# EAGLE design SomUSB2 (EAGLE 9.6.2)
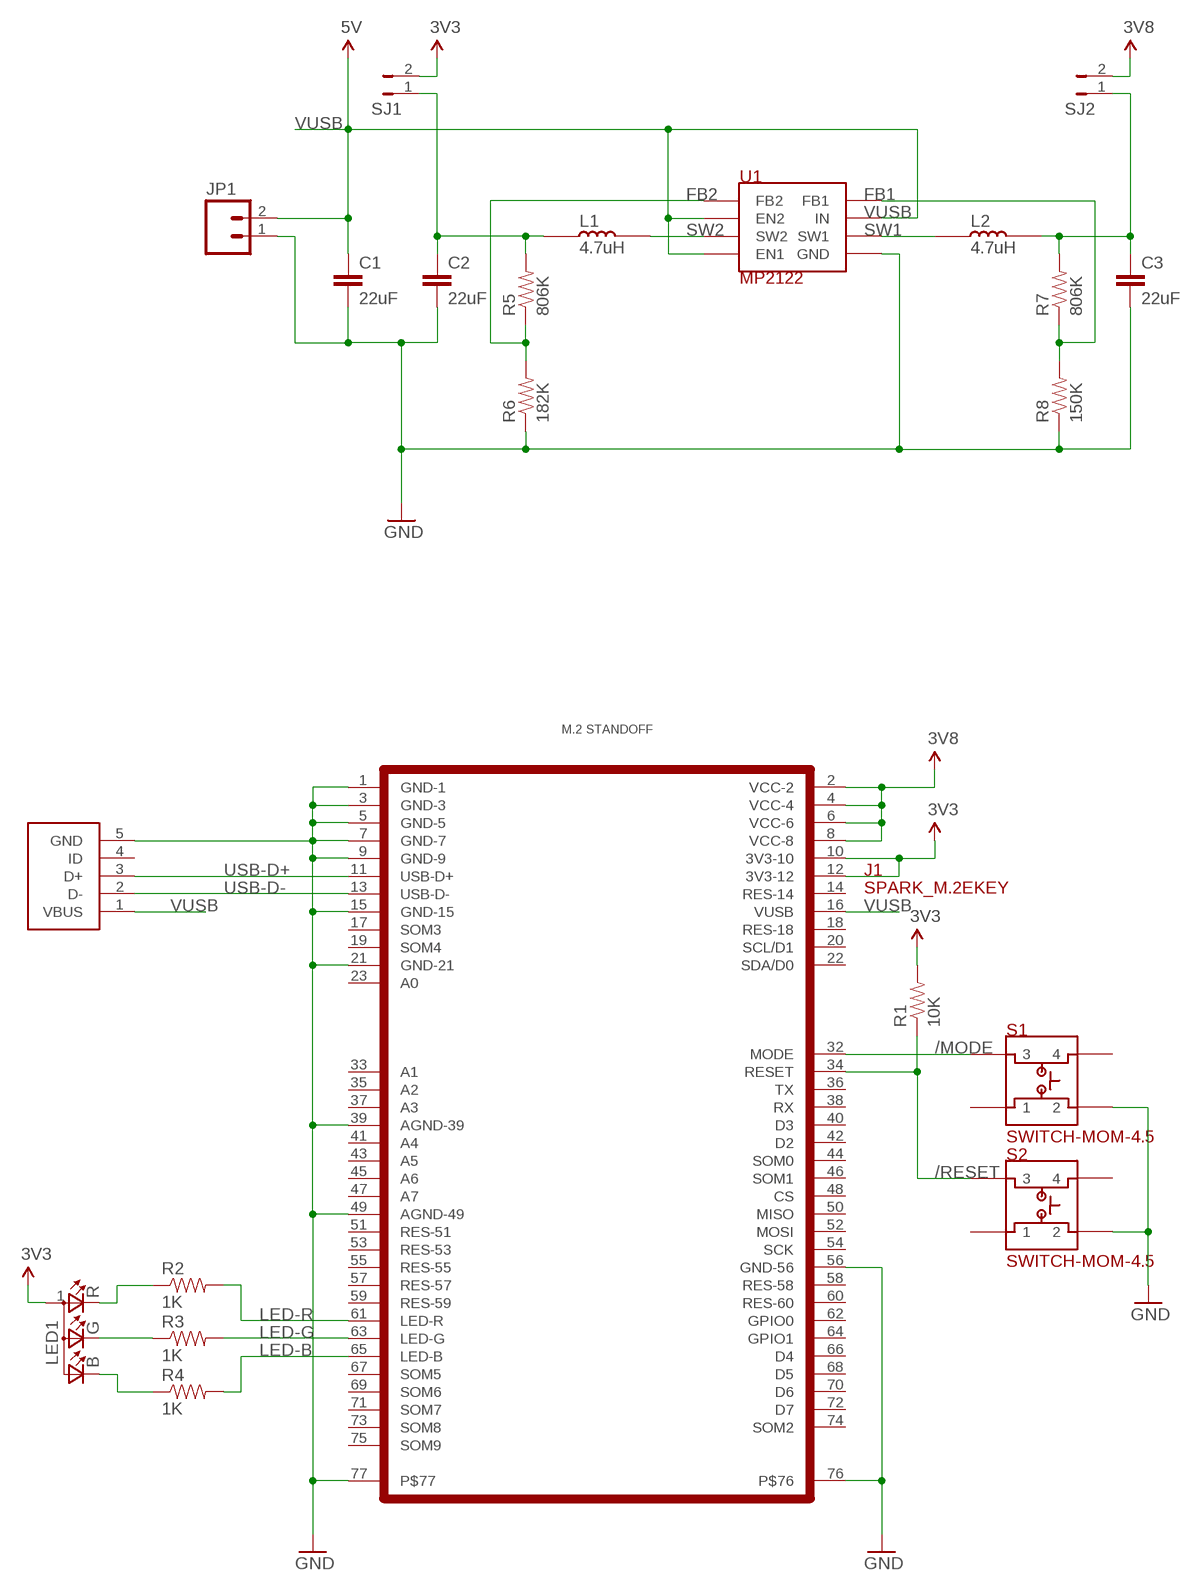
[diagram p0: schematic, sheet 1]

## Parts
C1  22uF  CAP-22UF-0805  [0805]
C2  22uF  CAP-22UF-0805  [0805]
C3  22uF  CAP-22UF-0805  [0805]
J1  SPARK_M.2EKEY  [SPARK_M.2EKEY-LESS-CREAM]
JP1  M02PTH  [1X02]
L1  4.7uH  INDUCTOR-4.7UH  [1008-BOURNS]
L2  4.7uH  INDUCTOR-4.7UH  [1008-BOURNS]
LED1  LED-RGB-CREE-SMD  [LED-RGB-CREE-SMD]
R1  10K  RES-10K-06030603  [0603-RES]
R2  1K  RES-1K-0603  [0603-RES]
R3  1K  RES-1K-0603  [0603-RES]
R4  1K  RES-1K-0603  [0603-RES]
R5  806K  RES-806K-0603  [0603-RES]
R6  182K  RES-182K-0603  [0603-RES]
R7  806K  RES-806K-0603  [0603-RES]
R8  150K  RES-150K-0603  [0603-RES]
S1  SWITCH-MOM-4.5  [SWITCH-MOM-4.5]
S2  SWITCH-MOM-4.5  [SWITCH-MOM-4.5]
SJ1  JUMPER-PTH-2-NO  [PTH-JUMPER-2-NO_NO_SILK]
SJ2  JUMPER-PTH-2-NO  [PTH-JUMPER-2-NO_NO_SILK]
U1  MP2122  MPS2112  [TSOT23-8-MPS]
U$1  M2-STANDOFF  [M2-STANDOFF]
U$3  USB-MICRO-B-SOCKET-AMPHENOL  [USB-B-SMT-AMPHENOL]

## Nets
3V3: J1.10(3V3-10) J1.12(3V3-12) LED1.1(A) R1.2 SJ1.2
3V3-REG: C2.1 L1.1 R5.2 SJ1.1
3V8: J1.2(VCC-2) J1.4(VCC-4) J1.6(VCC-6) J1.8(VCC-8) SJ2.2
3V8-REG: C3.1 L2.2 R7.2 SJ2.1
/MODE: J1.32(MODE) S1.3
/RESET: J1.34(RESET) R1.1 S2.3
FB1: R7.1 R8.2 U1.8(FB1)
FB2: R5.1 R6.2 U1.1(FB2)
GND: C1.2 C2.2 C3.2 J1.1(GND-1) J1.3(GND-3) J1.5(GND-5) J1.7(GND-7) J1.9(GND-9) J1.15(GND-15) J1.21(GND-21) J1.39(AGND-39) J1.49(AGND-49) J1.56(GND-56) J1.76 J1.77 JP1.1 R6.1 R8.1 S1.2 S2.2 U1.5(GND) U$3.5(GND)
LED-B: J1.65(LED-B) R4.2
LED-G: J1.63(LED-G) R3.2
LED-R: J1.61(LED-R) R2.2
N$2: LED1.3(G) R3.1
N$6: LED1.4(R) R2.1
N$10: LED1.2(B) R4.1
SW1: L2.1 U1.6(SW1)
SW2: L1.2 U1.3(SW2)
USB-D+: J1.11(USB-D+) U$3.3(D+)
USB-D-: J1.13(USB-D-) U$3.2(D-)
VUSB: C1.1 J1.16(VUSB) JP1.2 U1.2(EN2) U1.4(EN1) U1.7(IN) U$3.1(VBUS) ; supply symbol labelled 5V
Unconnected: J1.14(RES-14) J1.17(SOM3) J1.18(RES-18) J1.19(SOM4) J1.20(SCL/D1) J1.22(SDA/D0) J1.23(A0) J1.33(A1) J1.35(A2) J1.36(TX) J1.37(A3) J1.38(RX) J1.40(D3) J1.41(A4) J1.42(D2) J1.43(A5) J1.44(SOM0) J1.45(A6) J1.46(SOM1) J1.47(A7) J1.48(CS) J1.50(MISO) J1.51(RES-51) J1.52(MOSI) J1.53(RES-53) J1.54(SCK) J1.55(RES-55) J1.57(RES-57) J1.58(RES-58) J1.59(RES-59) J1.60(RES-60) J1.62(GPIO0) J1.64(GPIO1) J1.66(D4) J1.67(SOM5) J1.68(D5) J1.69(SOM6) J1.70(D6) J1.71(SOM7) J1.72(D7) J1.73(SOM8) J1.74(SOM2) J1.75(SOM9) S1.1 S1.4 S2.1 S2.4 U$3.4(ID)

## Library data of the parts
C1-C3 = rickk2:CAP-22UF-0805: 22 uF capacitor 6.3V 0805 $ .314 https://www.digikey.com/product-detail/en/murata-electronics-north-america/GRM219R61A226MEA0D/490-9951-1-ND/5026414
J1 = rickk2:SPARK_M.2EKEY: $1.42 CONN FEMALE 67POS 0.020 GOLD TE Connectivity AMP Connectors 2199230-4 https://www.digikey.com/product-detail/en/te-connectivity-amp-connectors/2199230-4/A115904CT-ND/4208916
JP1 = rickk2:M02: Standard 2-pin 0.1" header. Use with - straight break away headers ( PRT-00116) - right angle break away headers (PRT-00553) - swiss pins (PRT-00743) - machine pins (PRT-00117) - female headers (PRT-00115) Molex polarized connector foot print use with: PRT-08233 with associated crimp pins and housings. 2.54_SCREWTERM for use with PRT-10571. 3.5mm Screw Terminal footprints for PRT-08084 5mm Screw Terminal footprints for use with PRT-08432
L1 L2 = rickk2:INDUCTOR-4.7UH: FIXED IND 4.7UH 1.1A 110 MOHM $0.26 Bourns CVH252009-4R7M 4.7µH Shielded Multilayer Inductor 1.1A 110 mOhm Max 1008 (2520 Metric) https://www.digikey.com/product-detail/en/bourns-inc/CVH252009-4R7M/CVH252009-4R7MCT-ND/3440080
LED1 = rickk2:LED-RGB-CREE-SMD: LED RGB DIFFUSED 4SMD $ 0.35 Cree CLMVB-FKA-CFHEHLCBB7A363 2mm 4-PLCC common anode RGB LED https://www.digikey.com/product-detail/en/cree-inc/CLMVB-FKA-CFHEHLCBB7A363/CLMVB-FKA-CFHEHLCBB7A363CT-ND/6138627 Red=68 ohm, Green/Blue=33 ohm @ 3.3V
R1 = rickk2:RES-10K-0603: RES SMD 10K OHM 5% 1/4W 0603 $ 0.10 https://www.digikey.com/product-detail/en/panasonic-electronic-components/ERJ-PA3J103V/P10KBZCT-ND/5036237
R2-R4 = rickk2:RES-1K-0603: RES SMD 1K OHM 0.5% 1/5W 0603 $ 0.17 https://www.digikey.com/product-detail/en/panasonic-electronic-components/ERJ-PB3D1001V/P20283CT-ND/6214538 Panasonic
R5 R7 = rickk2:RES-806K-0603: Panasonic Electronic Components ERJ-3EKF8063V 806 kOhms ±1% 0.1W, 1/10W Chip Resistor 0603 (1608 Metric) Automotive AEC-Q200 Thick Film https://www.digikey.com/products/en/resistors/chip-resistor-surface-mount/52?k=&pkeyword=&sv=0&v=10&pv7=2&pv1989=0&pv2085=u806+kOhms&pv16=5&sf=1&FV=ffe00034&quantity=&ColumnSort=0&page=1&stock=1&pageSize=25
R6 = rickk2:RES-182K-0603: Panasonic Electronic Components ERJ-3EKF1823V 182 kOhms ±1% 0.1W, 1/10W Chip Resistor 0603 (1608 Metric) Automotive AEC-Q200 Thick Film https://www.digikey.com/product-detail/en/panasonic-electronic-components/ERJ-3EKF1823V/P182KHCT-ND/198208
R8 = rickk2:RES-150K-0603: RES SMD 150K OHM 1% 1/10W 0603 Panasonic Electronic Components ERJ-3EKF1503V 150 kOhms ±1% 0.1W, 1/10W Chip Resistor 0603 (1608 Metric) Automotive AEC-Q200 Thick Film https://www.digikey.com/product-detail/en/panasonic-electronic-components/ERJ-3EKF1503V/P150KHCT-ND/198178
S1 S2 = rickk2:SWITCH-MOM-4.5: Manufacturer: E-Switch Manufacturer Part Number: TL3305AF160QG Description: SWITCH TACTILE SPST-NO 50MA 12V Detailed Description: Tactile Switch SPST-NO Top Actuated Surface Mount $0.20 https://www.digikey.com/product-detail/en/e-switch/TL3305AF160QG/EG5350CT-ND/5816195
SJ1 SJ2 = rickk2:JUMPER-PTH-2-NO
U1 = rickk2:MPS2112: Monolithic Power Systems Inc. MP2122GJ-Z $2.51 IC REG BUCK ADJ 2A DL SYNC Buck Switching Regulator IC Positive Adjustable 0.608V 2 Output 2A SOT-23-8 Thin, TSOT-23-8 https://www.digikey.com/product-detail/en/monolithic-power-systems-inc/MP2122GJ-Z/1589-1872-1-ND/5291939
U$1 = rickk2:M2-STANDOFF: https://www.digikey.com/product-detail/en/jae-electronics/SM3ZS067U310-NUT1-R1800/670-2864-1-ND/5955848
U$3 = rickk2:USB-MICRO-B-SOCKET-AMPHENOL: CONN USB MICRO B RECPT SMT R/A $0.42 Amphenol FCI 10118194-0001LF https://www.digikey.com/products/en?keywords=609-4618-1-nd

## Board
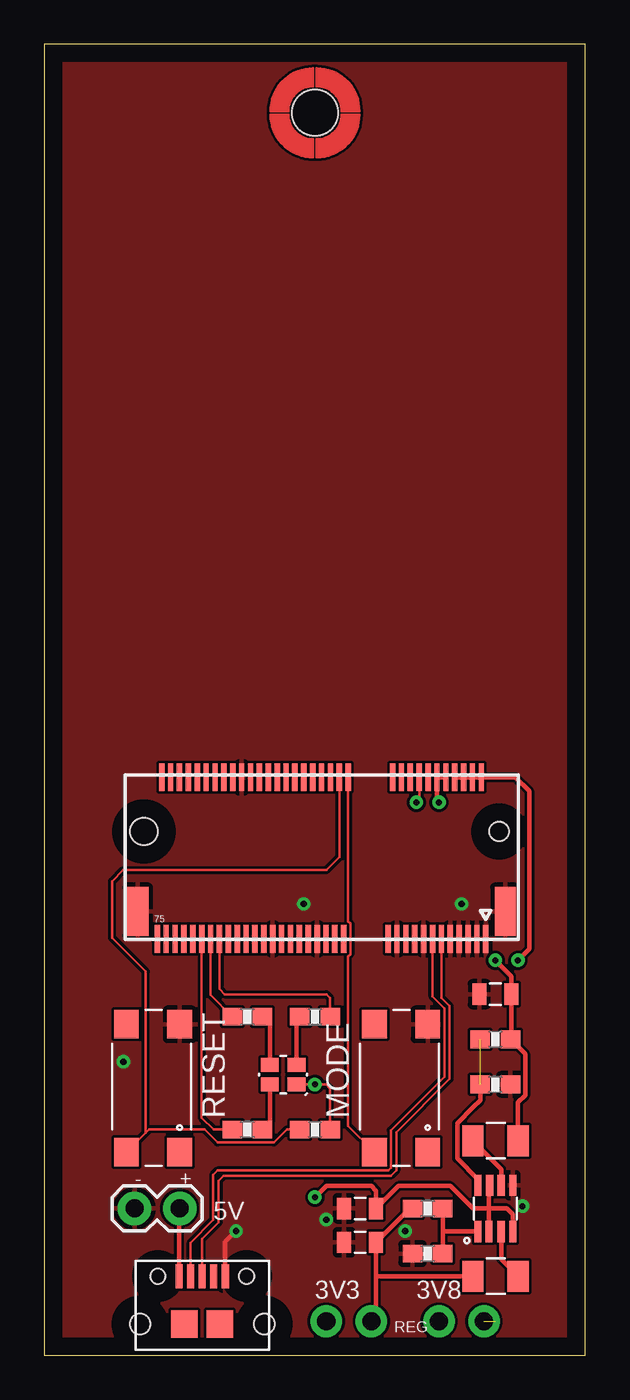
[diagram p1: board, top side]
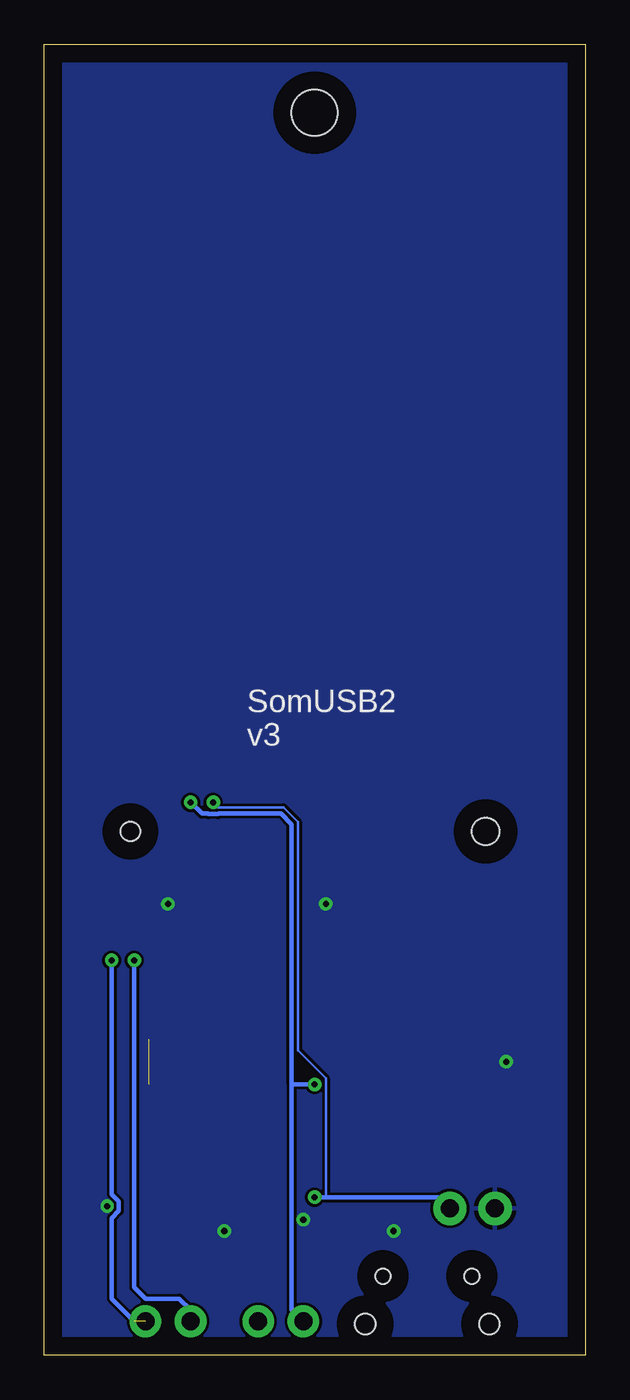
[diagram p2: board, bottom side, seen from below]

Size 30.46 x 73.79 mm. Coordinates in mm from the lower left corner, seen from the top.
Outline: 0,0 30.46,0 30.46,73.79 0,73.79 0,0
Copper layers (1*16): Top 0.035mm / dielectric 1.5mm / Bottom 0.035mm
Design rules "default": minimum track width 6mil, minimum drill 0.35mm, track to track 6mil, track to pad 6mil, pad to pad 6mil, via to via 6mil, smd to smd 6mil, copper to edge 40mil, drill to drill 6mil, minimum pad ring 10mil, minimum via ring 8mil, stop-mask expansion 4mil, vias tented up to drill 0mil, thermal gap 10mil

### Footprints (pad centres in the part's own frame; a part is rotated, then mirrored left to right if it is on the bottom)
0805 = smd 0.8 x 1.2: 1 -0.9,0; 2 0.9,0
SPARK_M.2EKEY-LESS-CREAM = smd 0.3 x 1.55: 1 -9.62,4.51; 2 -9.37,-4.59; 3 -9.12,4.51; 4 -8.87,-4.59; 5 -8.62,4.51; 6 -8.37,-4.59; 7 -8.12,4.51; 8 -7.87,-4.59; 9 -7.62,4.51; 10 -7.37,-4.59; 11 -7.12,4.51; 12 -6.87,-4.59; 13 -6.62,4.51; 14 -6.37,-4.59; 15 -6.12,4.51; 16 -5.87,-4.59; 17 -5.62,4.51; 18 -5.37,-4.59; 19 -5.12,4.51; 20 -4.87,-4.59; 21 -4.62,4.51; 22 -4.37,-4.59; 23 -4.12,4.51; 32 -1.87,-4.59; 33 -1.62,4.51; 34 -1.37,-4.59; 35 -1.12,4.51; 36 -0.87,-4.59; 37 -0.62,4.51; 38 -0.37,-4.59; 39 -0.12,4.51; 40 0.13,-4.59; 41 0.38,4.51; 42 0.63,-4.59; 43 0.88,4.51; 44 1.13,-4.59; 45 1.38,4.51; 46 1.63,-4.59; 47 1.88,4.51; 48 2.13,-4.59; 49 2.38,4.51; 50 2.63,-4.59; 51 2.88,4.51; 52 3.13,-4.59; 53 3.38,4.51; 54 3.63,-4.59; 55 3.88,4.51; 56 4.13,-4.59; 57 4.38,4.51; 58 4.63,-4.59; 59 4.88,4.51; 60 5.13,-4.59; 61 5.38,4.51; 62 5.63,-4.59; 63 5.88,4.51; 64 6.13,-4.59; 65 6.38,4.51; 66 6.63,-4.59; 67 6.88,4.51; 68 7.13,-4.59; 69 7.38,4.51; 70 7.63,-4.59; 71 7.88,4.51; 72 8.13,-4.59; 73 8.38,4.51; 74 8.63,-4.59; 75 8.88,4.51 | smd 1.2 x 2.75: 76 9.98,2.96; 77 -10.72,2.96 | hole 1.1: -10.37,-1.54 | hole 1.55: 9.63,-1.54
1X02 = drill 1.016 pad 1.88: 1 0,0; 2 2.54,0
1008-BOURNS = smd 1.2 x 1.75: 1 0,0; 2 2.55,0
LED-RGB-CREE-SMD = smd 1 x 0.8: 1 1.5,0; 2 0,0; 3 0,1.1; 4 1.5,1.1
0603-RES = smd 1.1 x 1: 1 -0.85,0; 2 0.85,0
SWITCH-MOM-4.5 = smd 1.6 x 1.4: 1 0,0; 2 7.2,0; 3 0,3; 4 7.2,3
PTH-JUMPER-2-NO_NO_SILK = drill 1.016 pad 1.778: 1 -1.27,0; 2 1.27,0
TSOT23-8-MPS = smd 0.4 x 1.2: 1 -0.975,-1.3; 2 -0.375,-1.3; 3 0.325,-1.3; 4 0.975,-1.3; 5 0.975,1.3; 6 0.325,1.3; 7 -0.325,1.3; 8 -0.975,1.3
M2-STANDOFF = hole 2.6: 0,0
USB-B-SMT-AMPHENOL = smd 0.4 x 1.35: 1 -1.3,0; 2 -0.65,0; 3 0,0; 4 0.65,0; 5 1.3,0 | smd 1.5 x 1.55: P$6 -1,-2.7; P$7 1,-2.7 | hole 0.85: -2.5,0; 2.5,0 | hole 1.15: -3.5,-2.7; 3.5,-2.7

### Placement (x,y rotation side)
C1  17.78,8.26 180 top
C2  17.78,6.35 180 top
C3  25.4,20.32 180 top
J1  15.24,27.94 180 top
JP1  5.08,8.26 0 top
L1  24.13,4.45 0 top
L2  24.13,12.06 0 top
LED1  12.7,15.24 0 top
R1  15.24,12.7 0 top
R2  15.24,19.05 0 top
R3  11.43,19.05 180 top
R4  11.43,12.7 180 top
R5  21.59,8.26 180 top
R6  21.59,5.71 0 top
R7  25.4,17.78 0 top
R8  25.4,15.24 180 top
S1  21.59,11.43 90 top
S2  7.62,11.43 90 top
SJ1  17.14,1.91 180 top
SJ2  23.5,1.91 0 top
U1  25.4,8.26 0 top
U$1  15.24,69.94 0 top
U$3  8.89,4.45 0 top

### Tracks (layer width: path | path; a pad name or v marks a point on that pad's centre or on a via)
3V3  (via drill 0.35)
  Top 0.152: LED1.1 v15.24,15.24 15.88,15.24 16.09,15.03 R1.2
  Top 0.254: v22.23,31.11 22.11,31.23 J1.12 J1.10
  Bottom 0.254: 16.53,15.24 16.53,2.56 SJ1.2 | v15.24,15.24 16.53,15.24 | 16.53,15.24 16.53,29.87 17.14,30.48 20.66,30.48 20.68,30.46 21.23,30.46 21.25,30.48 21.59,30.48 v22.23,31.11
3V3-REG
  Top 0.254: R5.2 20.59,8.26 C2.1 18.68,4.45 | SJ1.1 18.68,2.17 18.68,4.45 | L1.1 18.68,4.45
3V8  (via drill 0.35)  (1 unrouted)
  Top 0.254: J1.8 J1.6 J1.4 J1.2 26.52,32.53 27.3,31.75 27.3,22.86 v26.67,22.23
  Bottom 0.254: v26.67,22.23 26.67,9.06 26.27,8.65 26.27,8.11 26.67,7.71 26.67,3.17 25.4,1.91
3V8-REG  (via drill 0.35)
  Top 0.254: L2.2 26.68,14.22 27.08,14.62 27.08,16.95 R7.2 26.3,17.83 C3.1 26.3,21.32 v25.4,22.23
  Bottom 0.254: SJ2.1 22.23,2.54 22.86,3.17 24.77,3.17 25.4,3.81 v25.4,22.23
/MODE
  Top 0.152: S1.3 17.11,12.91 17.11,22.43 17.24,22.56 17.24,24.3 17.11,24.43 J1.32
/RESET
  Top 0.152: 5.71,12.53 5.71,21.59 3.81,23.5 3.81,26.67 4.45,27.3 15.88,27.3 16.61,28.04 J1.34 | 5.71,12.53 5.89,12.7 9.02,12.7 9.75,11.97 12.93,11.97 13.65,12.7 R1.1 | S2.3 5.71,12.53
FB1  (1 unrouted)
  Top 0.254: U1.8 24.43,9.9 23.25,11.07 23.25,13.06 24.15,13.95 24.55,14.36 R8.2
FB2
  Top 0.254: R5.1 22.47,8.22 22.44,8.2 22.44,6.99 | R6.2 22.44,6.99 | U1.1 22.47,6.96 22.44,6.99
GND  (via drill 0.35)
  Top 0.254: U$3.5 10.19,6.38 v10.79,6.99
  other vias: 23.5,25.4 4.45,16.51 20.32,6.99 15.88,7.62 14.61,25.4 26.92,8.38
  pour Top: 0,0 0,74.34 33.02,74.34 33.02,0
  pour Bottom: 0,0 0,73.88 31.75,73.88 31.75,0
LED-B
  Top 0.152: R4.2 9.53,12.7 8.86,13.37 J1.65
LED-G
  Top 0.152: R3.2 9.36,20.27 J1.63
LED-R
  Top 0.152: R2.2 16.09,20.11 15.88,20.32 10.16,20.32 9.86,20.62 J1.61
N$2
  Top 0.254: LED1.3 12.7,18.63 R3.1
N$6
  Top 0.254: LED1.4 14.2,18.86 R2.1
N$10
  Top 0.254: LED1.2 12.7,13.12 R4.1
SW1
  Top 0.254: U1.6 25.73,10.47 L2.1
SW2
  Top 0.254: U1.3 25.73,5.4 L1.2
USB-D+
  Top 0.152: J1.11 22.36,20.11 22.82,19.65 22.82,15.54 19.82,12.54 19.82,10.41 19.51,10.1 10.1,10.1 9.81,9.81 9.81,7.48 8.89,6.55 U$3.3
USB-D-
  Top 0.152: J1.13 21.86,20.18 22.52,19.52 22.52,15.67 19.52,12.67 19.52,10.54 19.39,10.4 9.77,10.4 9.51,10.14 9.51,7.61 8.24,6.33 U$3.2
VUSB  (via drill 0.35)
  Top 0.152: v20.95,31.11 21.11,31.27 J1.16
  Top 0.254: U1.2 25.02,8.26 | 25.02,8.26 25.02,9.51 U1.7 | U1.4 26.38,7.92 26.04,8.26 25.02,8.26 | 25.02,8.26 24.13,8.26 22.86,9.53 19.95,9.53 C1.1 18.68,9.26 18.41,9.53 15.88,9.53 v15.24,8.89 | U$3.1 7.59,8.22 JP1.2
  Bottom 0.152: v20.95,31.11 20.68,30.84 17,30.84 16.18,30.02 16.18,17.14 14.61,15.57 14.61,8.89
  Bottom 0.254: v15.24,8.89 14.61,8.89 8.26,8.89 JP1.2

### Text on the board
tPlace: RESET | MODE | - | + | 5V | 3V3 | 3V8 | REG
bPlace: SomUSB2 / v3